# EAGLE design RGB LED (EAGLE 7.6.0)
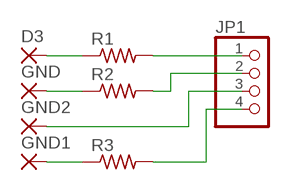
[diagram p0: schematic, sheet 1]

## Parts
D3  2,15/1,0  [2,15/1,0]
GND  2,15/1,0  [2,15/1,0]
GND1  2,15/1,0  [2,15/1,0]
GND2  2,15/1,0  [2,15/1,0]
JP1  PINHD-1X4  [1X04]
R1  R-US_R1206  [R1206]
R2  R-US_R1206  [R1206]
R3  R-US_R1206  [R1206]

## Nets
GND: GND2.1(P) JP1.3
N$1: D3.1(P) R1.1
N$2: GND.1(P) R2.1
N$3: GND1.1(P) R3.1
N$4: JP1.2 R2.2
N$6: JP1.4 R3.2
N$8: JP1.1 R1.2

## Library data of the parts
D3 GND GND1 GND2 = wirepad:2,15/1,0: THROUGH-HOLE PAD
JP1 = pinhead:PINHD-1X4: PIN HEADER
R1-R3 = rcl:R-US_: RESISTOR, American symbol

## Board
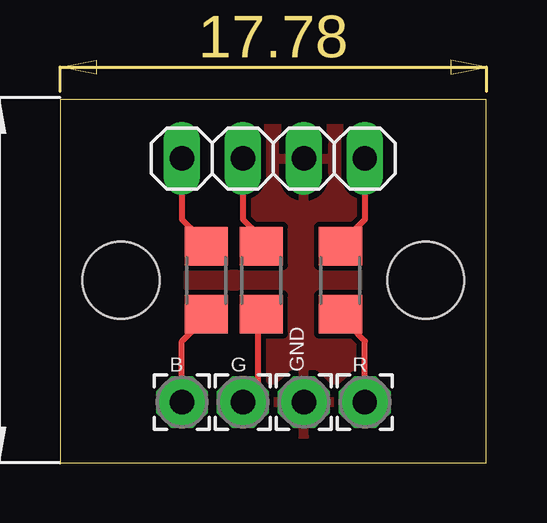
[diagram p1: board, top side]
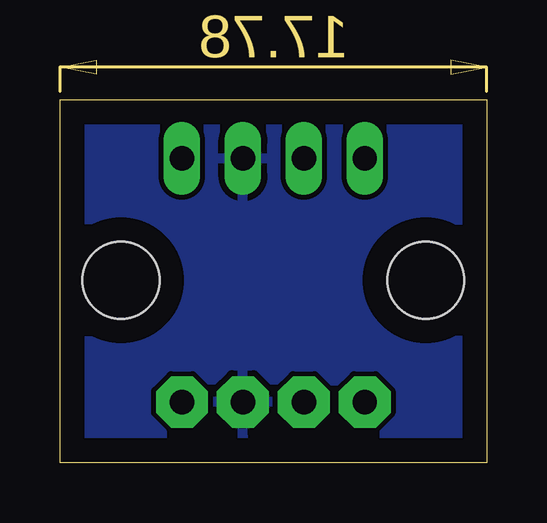
[diagram p2: board, bottom side, seen from below]

Size 17.76 x 15.16 mm. Coordinates in mm from the lower left corner, seen from the top.
Outline: 0,0 17.76,0 17.76,15.16 0,15.16 0,0
Copper layers (1*16): Top 0.035mm / dielectric 1.5mm / Bottom 0.035mm
Design rules "default": minimum track width 10mil, minimum drill 24mil, track to track 8mil, track to pad 8mil, pad to pad 8mil, via to via 8mil, smd to smd 8mil, copper to edge 40mil, drill to drill 8mil, minimum pad ring 10mil, minimum via ring 8mil, stop-mask expansion 4mil, vias tented up to drill 0mil, thermal gap 10mil
Holes 3.2 mm at 15.24,7.62 2.54,7.62

### Footprints (pad centres in the part's own frame; a part is rotated, then mirrored left to right if it is on the bottom)
2,15/1,0 = drill 1.016 pad 2.159 octagon: 1 0,0
1X04 = drill 1.016 long: 1 -3.81,0; 2 -1.27,0; 3 1.27,0; 4 3.81,0
R1206 = smd 1.6 x 1.803: 1 -1.422,0; 2 1.422,0

### Placement (x,y rotation side)
D3  5.08,2.54 0 top
GND  7.62,2.54 0 top
GND1  12.7,2.54 0 top
GND2  10.16,2.54 0 top
JP1  8.89,12.7 0 top
R1  6.1,7.62 90 top
R2  8.38,7.62 90 top
R3  11.68,7.62 90 top

### Tracks (layer width: path | path; a pad name or v marks a point on that pad's centre or on a via)
GND
  pour Bottom: 0,0 17.78,0 17.78,15.49 0,15.49
  pour Top: 0,0 0,15.49 17.78,15.49 17.78,0
N$1
  Top 0.254: D3.1 5.08,5.08 5.71,5.71 R1.1
N$2
  Top 0.254: GND.1 8.26,3.17 8.26,5.71 R2.1
N$3
  Top 0.254: GND1.1 12.7,5.08 12.06,5.71 R3.1
N$4
  Top 0.254: JP1.2 7.62,10.16 8.26,9.53 R2.2
N$6
  Top 0.254: JP1.4 12.7,10.16 12.06,9.53 R3.2
N$8
  Top 0.254: JP1.1 5.08,10.16 5.71,9.53 R1.2

### Text on the board
tPlace: B | G | GND | R